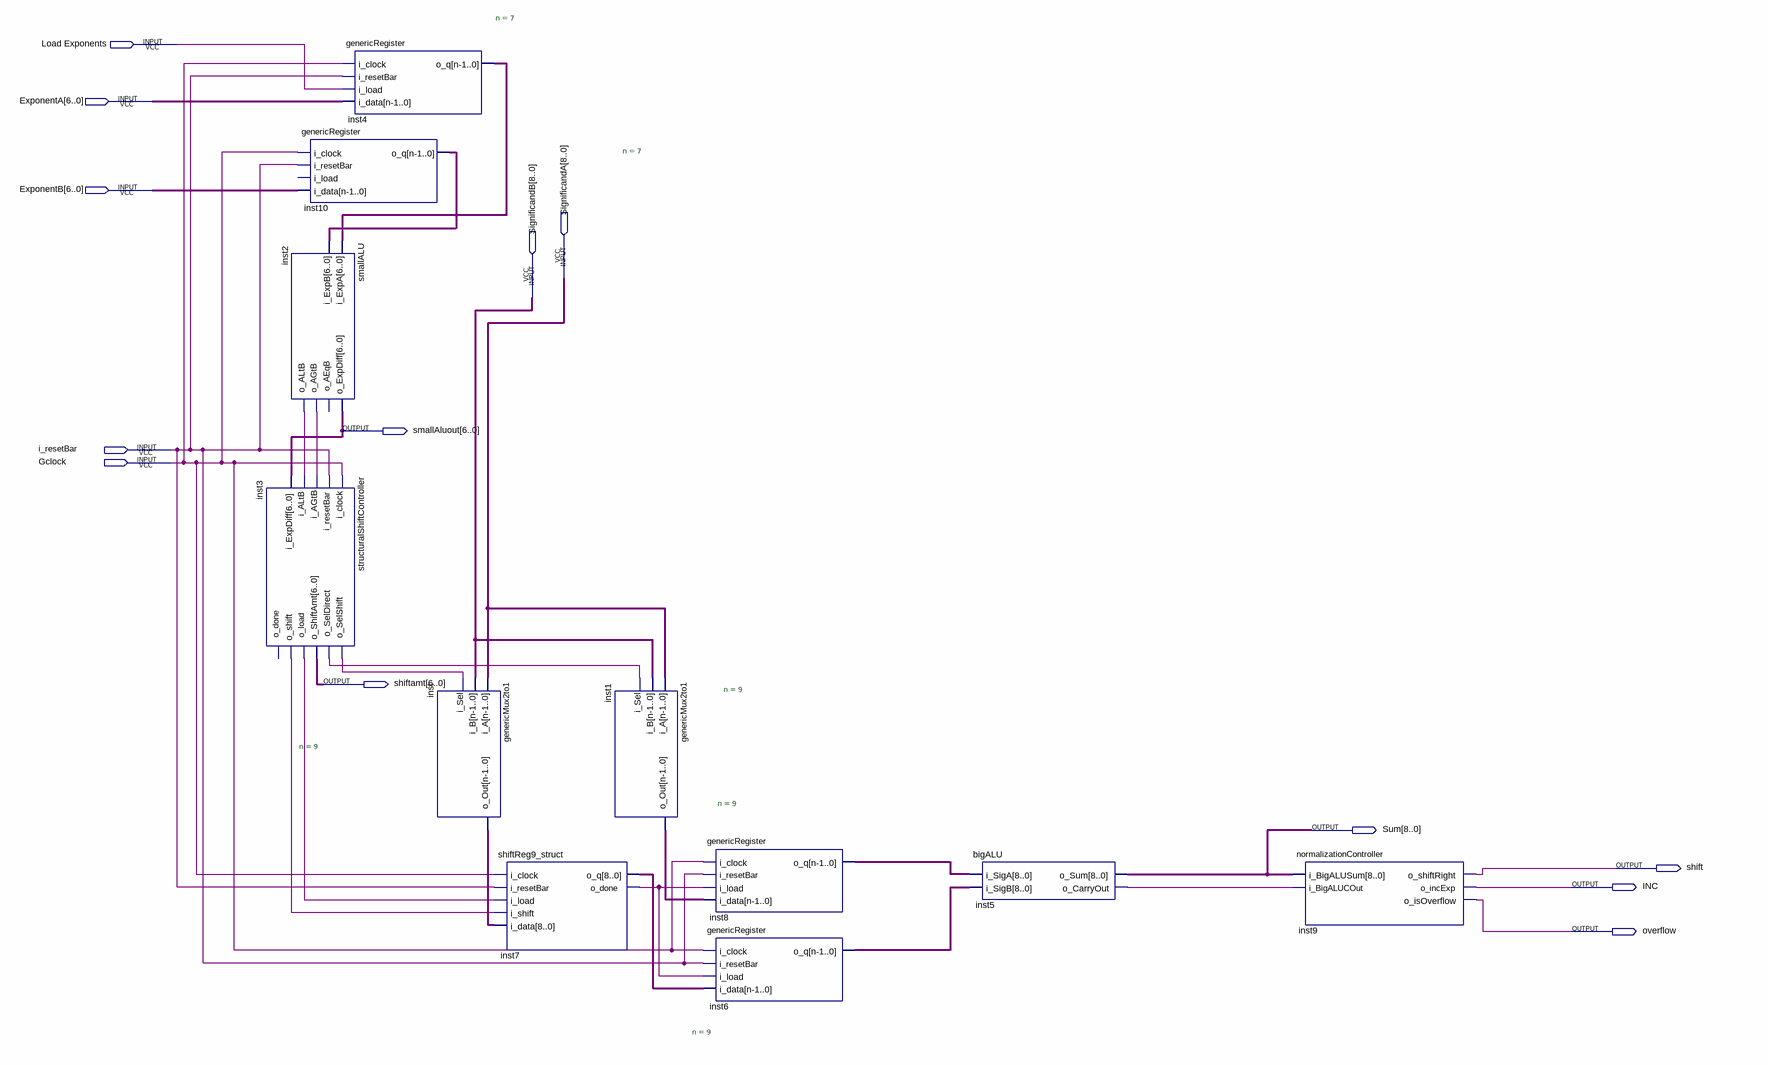
[diagram p0: schematic sheet]
// Quartus schematic toplevelfpadder.bdf as structural Verilog: 11 symbols, 13 pins
module toplevelfpadder (
  input  \Load_Exponents ,
  input  [6:0] ExponentA,
  input  [6:0] ExponentB,
  input  [8:0] SignificandA,
  input  [8:0] SignificandB,
  input  i_resetBar,
  input  Gclock,
  output [6:0] smallAluout,
  output [6:0] shiftamt,
  output [8:0] Sum,
  output shift,
  output INC,
  output overflow
);

  wire inst2_o_agtb, inst2_o_altb, inst3_o_load, inst3_o_seldirect, inst3_o_selshift, inst3_o_shift,
       inst5_o_carryout, inst7_o_done;
  wire [6:0] inst4_o_q, inst10_o_q;
  wire [8:0] inst1_o_out, inst6_o_q, inst7_o_q, inst8_o_q, inst_o_out;

  structuralShiftController inst3 (
    .i_clock(Gclock), .i_resetBar(i_resetBar), .i_AGtB(inst2_o_agtb), .i_ALtB(inst2_o_altb),
    .i_ExpDiff(smallAluout), .o_SelShift(inst3_o_selshift), .o_SelDirect(inst3_o_seldirect),
    .o_ShiftAmt(shiftamt), .o_load(inst3_o_load), .o_shift(inst3_o_shift));  // open: o_done
  genericRegister #(.n(7)) inst10 (
    .i_clock(Gclock), .i_resetBar(i_resetBar), .i_data(ExponentB), .o_q(inst10_o_q));  // open: i_load
  smallALU inst2 (
    .i_ExpA(inst4_o_q), .i_ExpB(inst10_o_q), .o_ExpDiff(smallAluout), .o_AGtB(inst2_o_agtb),
    .o_ALtB(inst2_o_altb));  // open: o_AEqB
  genericRegister #(.n(7)) inst4 (
    .i_clock(Gclock), .i_resetBar(i_resetBar), .i_load(\Load_Exponents ), .i_data(ExponentA), .o_q(inst4_o_q));
  genericMux2to1 #(.n(9)) inst (.i_A(SignificandA), .i_B(SignificandB), .i_Sel(inst3_o_selshift), .o_Out(inst_o_out));
  shiftReg9_struct inst7 (
    .i_clock(Gclock), .i_resetBar(i_resetBar), .i_load(inst3_o_load), .i_shift(inst3_o_shift),
    .i_data(inst_o_out), .o_q(inst7_o_q), .o_done(inst7_o_done));
  genericMux2to1 #(.n(9)) inst1 (
    .i_A(SignificandA), .i_B(SignificandB), .i_Sel(inst3_o_seldirect), .o_Out(inst1_o_out));
  genericRegister #(.n(9)) inst8 (
    .i_clock(Gclock), .i_resetBar(i_resetBar), .i_load(inst7_o_done), .i_data(inst1_o_out), .o_q(inst8_o_q));
  genericRegister #(.n(9)) inst6 (
    .i_clock(Gclock), .i_resetBar(i_resetBar), .i_load(inst7_o_done), .i_data(inst7_o_q), .o_q(inst6_o_q));
  bigALU inst5 (.i_SigA(inst8_o_q), .i_SigB(inst6_o_q), .o_Sum(Sum), .o_CarryOut(inst5_o_carryout));
  normalizationController inst9 (
    .i_BigALUSum(Sum), .i_BigALUCOut(inst5_o_carryout), .o_shiftRight(shift), .o_incExp(INC),
    .o_isOverflow(overflow));
endmodule
